# EAGLE design SpeakModule (EAGLE 9.1.0)
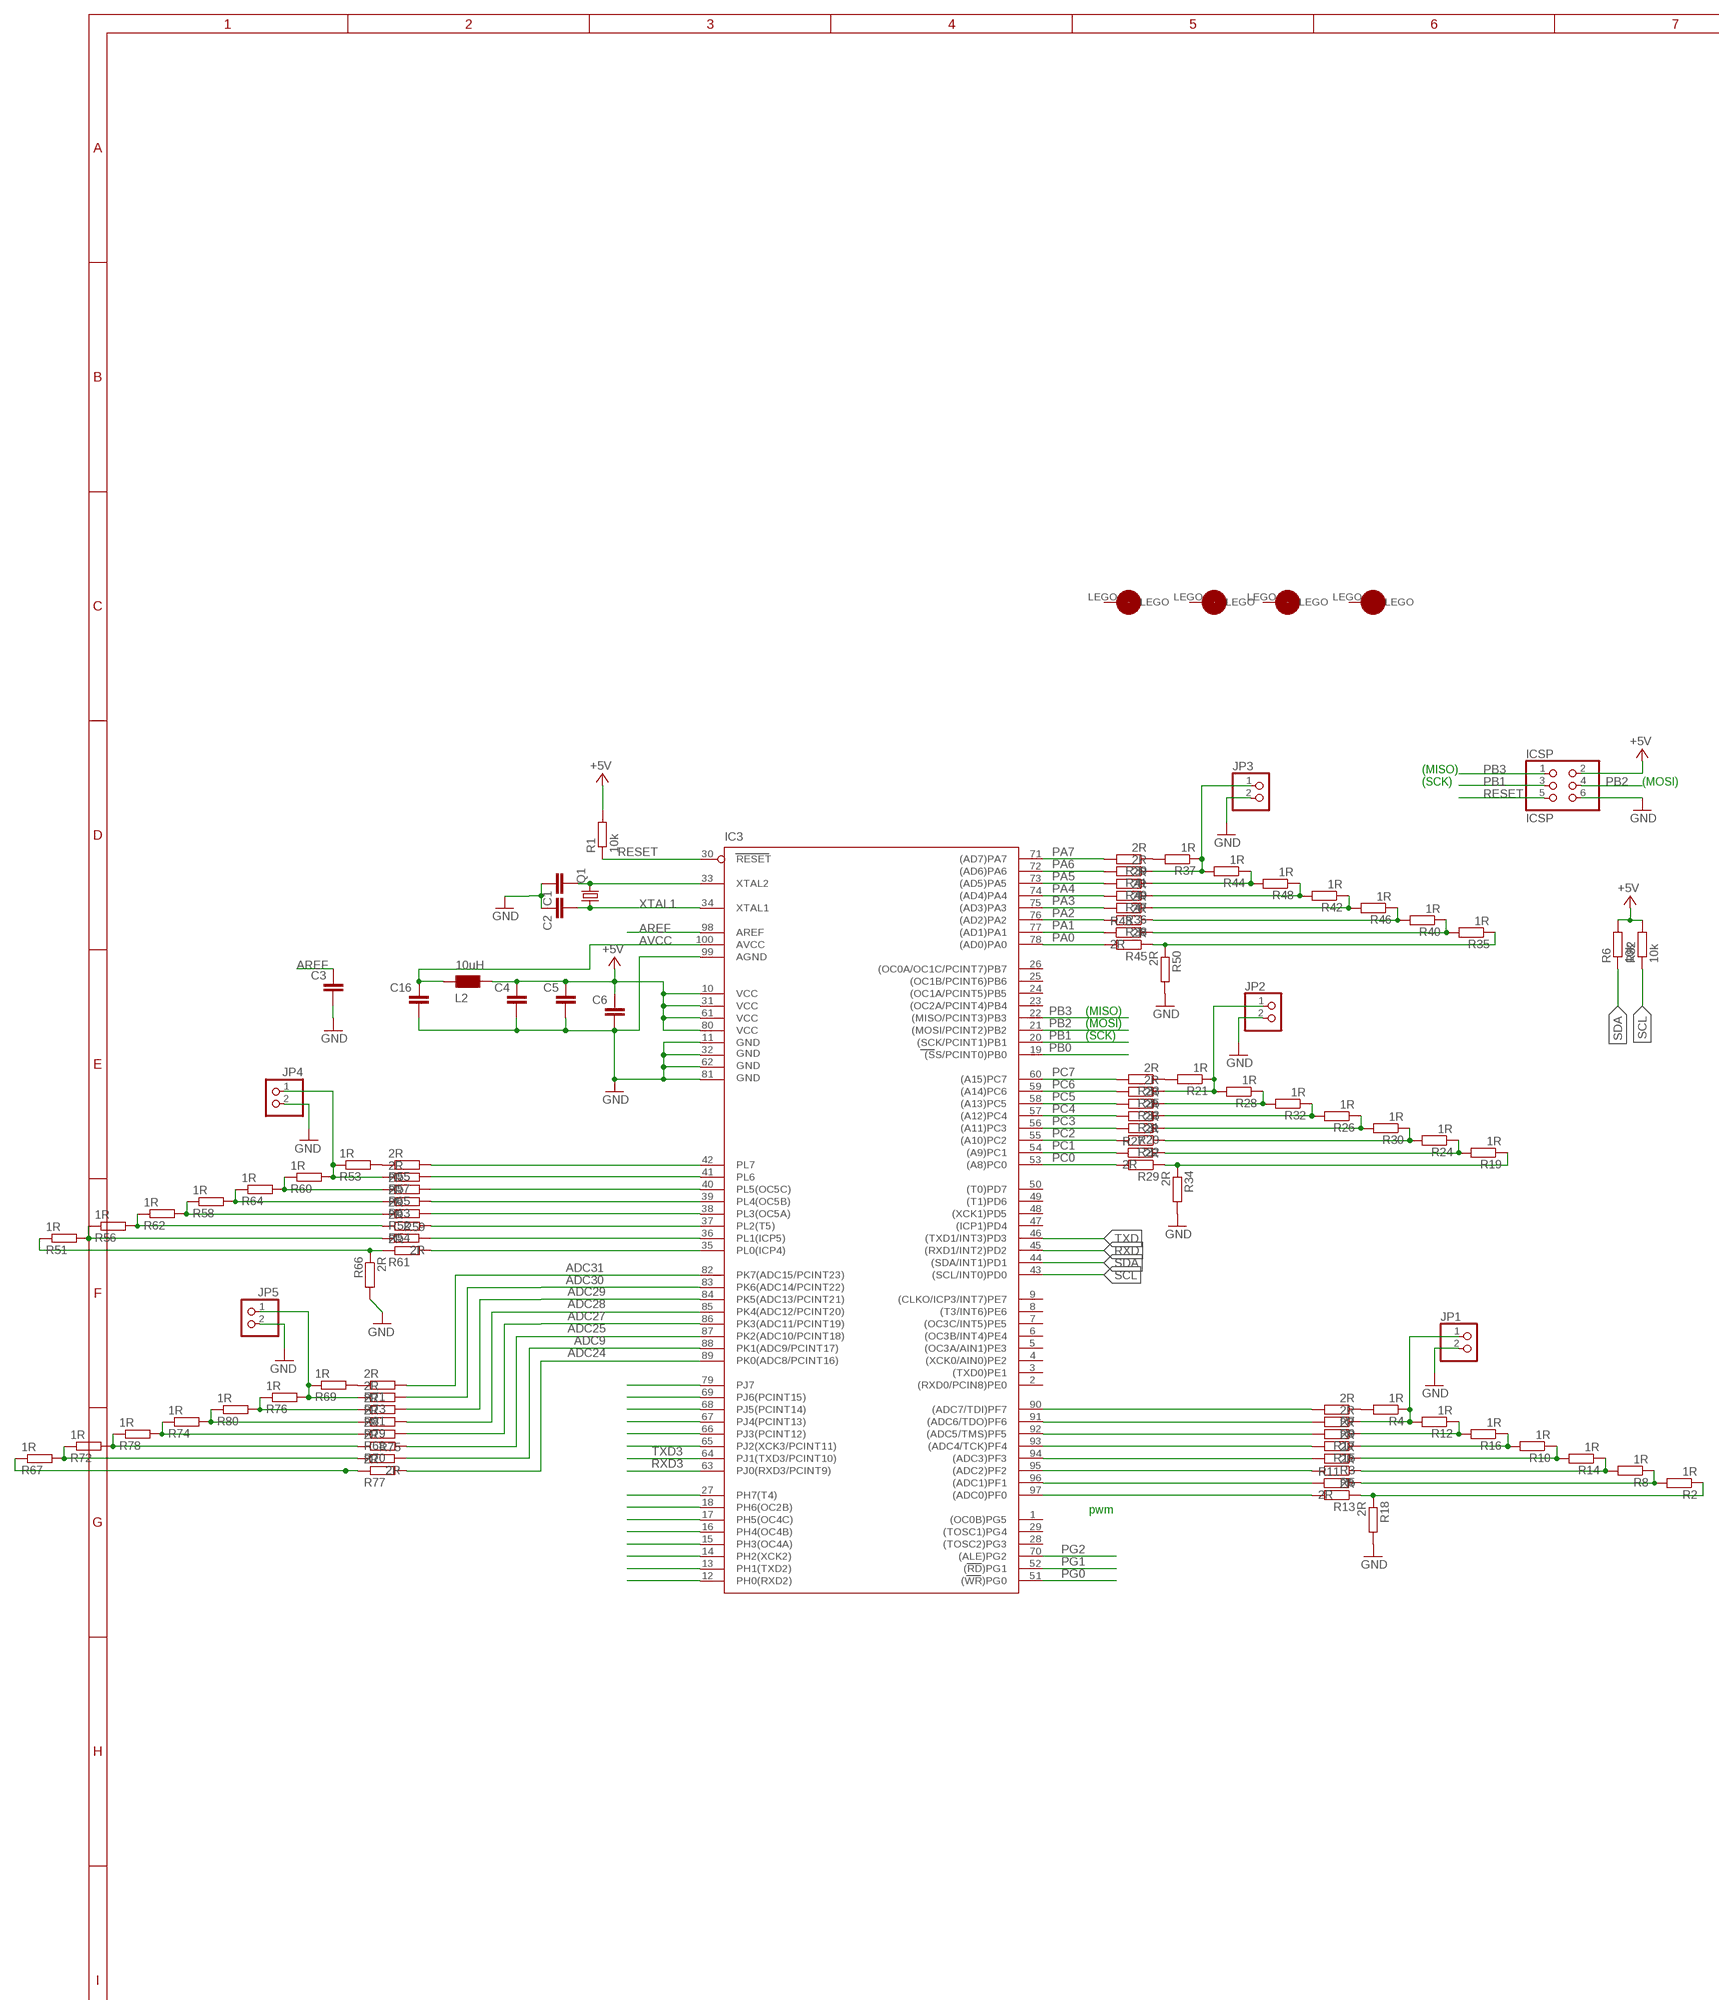
[diagram p0: schematic, sheet 1, part 1 of 2]
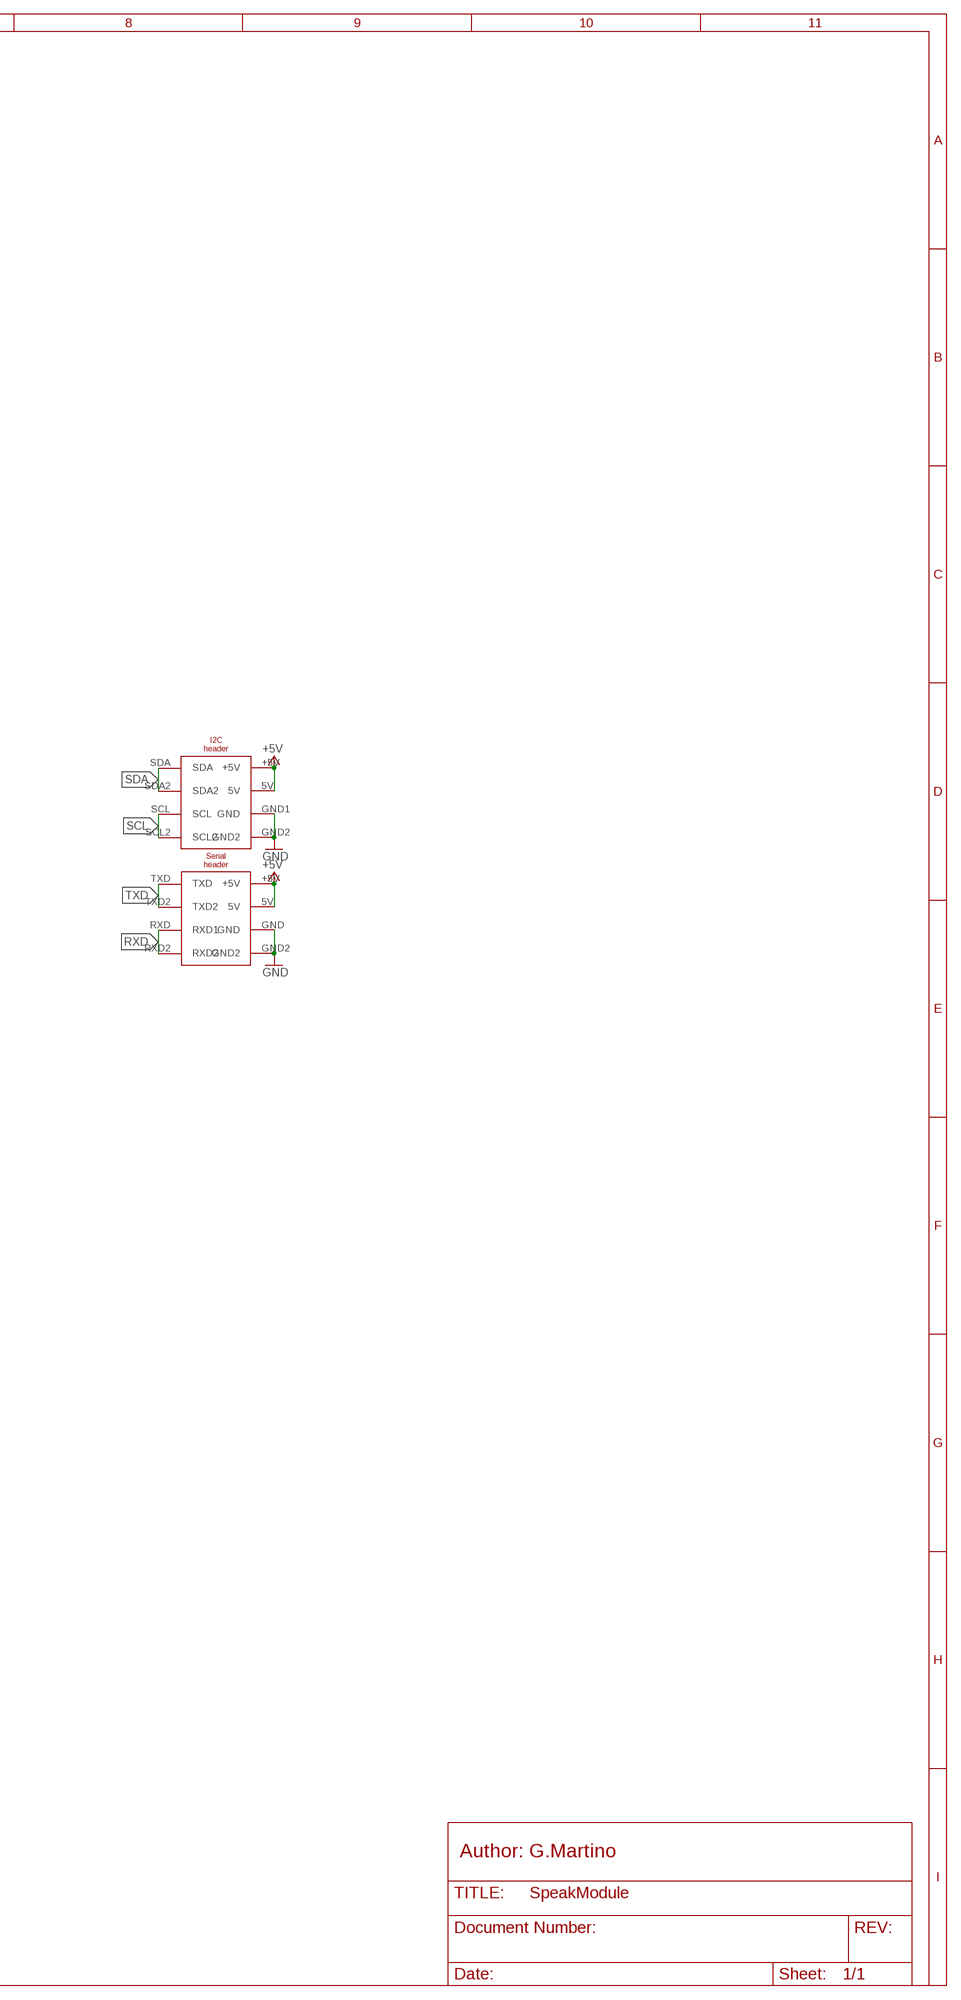
[diagram p1: schematic, sheet 1, part 2 of 2]

## Parts
C1  22pf  C-EUC1206  [C1206]
C2  22pf  C-EUC1206  [C1206]
C3  100nF  C-EUC1206  [C1206]
C4  100nF  C-EUC1206  [C1206]
C5  100nF  C-EUC1206  [C1206]
C6  100nF  C-EUC1206  [C1206]
C16  100nF  C-EUC1206  [C1206]
IC3  ATMEGA2560-15AU  0023_ATMEGA2560-16AU  [TQFP100]
ICSP  ICSP  0114_PH254-203DF118A00V  [2X03]
JP1  PINHD-1X2  [1X02]
JP2  PINHD-1X2  [1X02]
JP3  PINHD-1X2  [1X02]
JP4  PINHD-1X2  [1X02]
JP5  PINHD-1X2  [1X02]
L2  10uH  0715_CV201210-100K  [0805]
Q1  CRYSTALHC49S  [HC49/S]
R1  10k  R-EU_M1206  [M1206]
R2  1R  R-EU_M1206  [M1206]
R3  2R  R-EU_M1206  [M1206]
R4  1R  R-EU_M1206  [M1206]
R5  2R  R-EU_M1206  [M1206]
R6  10k  R-EU_M1206  [M1206]
R7  2R  R-EU_M1206  [M1206]
R8  1R  R-EU_M1206  [M1206]
R9  2R  R-EU_M1206  [M1206]
R10  1R  R-EU_M1206  [M1206]
R11  2R  R-EU_M1206  [M1206]
R12  1R  R-EU_M1206  [M1206]
R13  2R  R-EU_M1206  [M1206]
R14  1R  R-EU_M1206  [M1206]
R15  2R  R-EU_M1206  [M1206]
R16  1R  R-EU_M1206  [M1206]
R17  2R  R-EU_M1206  [M1206]
R18  2R  R-EU_M1206  [M1206]
R19  1R  R-EU_M1206  [M1206]
R20  2R  R-EU_M1206  [M1206]
R21  1R  R-EU_M1206  [M1206]
R22  2R  R-EU_M1206  [M1206]
R23  2R  R-EU_M1206  [M1206]
R24  1R  R-EU_M1206  [M1206]
R25  2R  R-EU_M1206  [M1206]
R26  1R  R-EU_M1206  [M1206]
R27  2R  R-EU_M1206  [M1206]
R28  1R  R-EU_M1206  [M1206]
R29  2R  R-EU_M1206  [M1206]
R30  1R  R-EU_M1206  [M1206]
R31  2R  R-EU_M1206  [M1206]
R32  1R  R-EU_M1206  [M1206]
R33  2R  R-EU_M1206  [M1206]
R34  2R  R-EU_M1206  [M1206]
R35  1R  R-EU_M1206  [M1206]
R36  2R  R-EU_M1206  [M1206]
R37  1R  R-EU_M1206  [M1206]
R38  2R  R-EU_M1206  [M1206]
R39  2R  R-EU_M1206  [M1206]
R40  1R  R-EU_M1206  [M1206]
R41  2R  R-EU_M1206  [M1206]
R42  1R  R-EU_M1206  [M1206]
R43  2R  R-EU_M1206  [M1206]
R44  1R  R-EU_M1206  [M1206]
R45  2R  R-EU_M1206  [M1206]
R46  1R  R-EU_M1206  [M1206]
R47  2R  R-EU_M1206  [M1206]
R48  1R  R-EU_M1206  [M1206]
R49  2R  R-EU_M1206  [M1206]
R50  2R  R-EU_M1206  [M1206]
R51  1R  R-EU_M1206  [M1206]
R52  2R  R-EU_M1206  [M1206]
R53  1R  R-EU_M1206  [M1206]
R54  2R  R-EU_M1206  [M1206]
R55  2R  R-EU_M1206  [M1206]
R56  1R  R-EU_M1206  [M1206]
R57  2R  R-EU_M1206  [M1206]
R58  1R  R-EU_M1206  [M1206]
R59  2R  R-EU_M1206  [M1206]
R60  1R  R-EU_M1206  [M1206]
R61  2R  R-EU_M1206  [M1206]
R62  1R  R-EU_M1206  [M1206]
R63  2R  R-EU_M1206  [M1206]
R64  1R  R-EU_M1206  [M1206]
R65  2R  R-EU_M1206  [M1206]
R66  2R  R-EU_M1206  [M1206]
R67  1R  R-EU_M1206  [M1206]
R68  2R  R-EU_M1206  [M1206]
R69  1R  R-EU_M1206  [M1206]
R70  2R  R-EU_M1206  [M1206]
R71  2R  R-EU_M1206  [M1206]
R72  1R  R-EU_M1206  [M1206]
R73  2R  R-EU_M1206  [M1206]
R74  1R  R-EU_M1206  [M1206]
R75  2R  R-EU_M1206  [M1206]
R76  1R  R-EU_M1206  [M1206]
R77  2R  R-EU_M1206  [M1206]
R78  1R  R-EU_M1206  [M1206]
R79  2R  R-EU_M1206  [M1206]
R80  1R  R-EU_M1206  [M1206]
R81  2R  R-EU_M1206  [M1206]
R82  10k  R-EU_M1206  [M1206]
U$1  LEGO-1X1  [LEGO-1X1]
U$2  LEGO-1X1  [LEGO-1X1]
U$3  LEGO-1X1  [LEGO-1X1]
U$4  LEGO-1X1  [LEGO-1X1]
U$5  I2C_HEADER  [I2_HEADER]
U$6  SERIAL_HEADER  [SERIAL_HEADER]

## Nets
+5V [power usb]: C4.1 C5.1 C6.1 IC3.10(VCC) IC3.31(VCC1) IC3.61(VCC2) IC3.80(VCC3) ICSP.2 L2.2 R1.2 R6.2 R82.2 U$5.5V U$5.+5V U$6.5V U$6.+5V
ADC0: IC3.97((ADC0)PF0) R13.2
ADC1: IC3.96((ADC1)PF1) R11.1
ADC2: IC3.95((ADC2)PF2) R5.2
ADC3: IC3.94((ADC3)PF3) R3.2
ADC4: IC3.93((ADC4/TCK)PF4) R15.2
ADC5: IC3.92((ADC5/TMS)PF5) R17.2
ADC6: IC3.91((ADC6/TDO)PF6) R9.2
ADC7: IC3.90((ADC7/TDI)PF7) R7.2
ADC9: IC3.88(PK1(ADC9/PCINT17)) R75.1
ADC16: IC3.35(PL0(ICP4)) R61.2
ADC17: IC3.37(PL2(T5)) R54.2
ADC18: IC3.36(PL1(ICP5)) R59.1
ADC19: IC3.38(PL3(OC5A)) R52.2
ADC20: IC3.39(PL4(OC5B)) R63.2
ADC21: IC3.40(PL5(OC5C)) R65.2
ADC22: IC3.41(PL6) R57.2
ADC23: IC3.42(PL7) R55.2
ADC24: IC3.89(PK0(ADC8/PCINT16)) R77.2
ADC25: IC3.87(PK2(ADC10/PCINT18)) R70.2
ADC27: IC3.86(PK3(ADC11/PCINT19)) R68.2
ADC28: IC3.85(PK4(ADC12/PCINT20)) R79.2
ADC29: IC3.84(PK5(ADC13/PCINT21)) R81.2
ADC30: IC3.83(PK6(ADC14/PCINT22)) R73.2
ADC31: IC3.82(PK7(ADC15/PCINT23)) R71.2
AREF: C3.1 IC3.98(AREF)
AVCC [power usb]: C16.1 IC3.100(AVCC) L2.1
GND [gnd]: C1.1 C2.1 C3.2 C4.2 C5.2 C6.2 C16.2 IC3.11(GND) IC3.32(GND1) IC3.62(GND2) IC3.81(GND3) IC3.99(AGND) ICSP.6 JP1.2 JP2.2 JP3.2 JP4.2 JP5.2 R18.2 R34.2 R50.2 R66.2 U$5.GND1(GND) U$5.GND2 U$6.GND U$6.GND2
N$1: C1.2 IC3.33(XTAL2) Q1.2
N$2: IC3.27(PH7(T4))
N$3: IC3.18(PH6(OC2B))
N$4: IC3.17(PH5(OC4C))
N$5: IC3.16(PH4(OC4B))
N$6: IC3.15(PH3(OC4A))
N$7: IC3.14(PH2(XCK2))
N$8: IC3.13(PH1(TXD2))
N$9: IC3.12(PH0(RXD2))
N$10: IC3.65(PJ2(XCK3/PCINT11))
N$11: IC3.66(PJ3(PCINT12))
N$12: IC3.67(PJ4(PCINT13))
N$13: IC3.68(PJ5(PCINT14))
N$14: IC3.69(PJ6(PCINT15))
N$15: IC3.79(PJ7)
N$16: R4.2 R7.1
N$17: JP1.1 R4.1 R9.1 R12.2
N$18: R12.1 R16.2 R17.1
N$19: R10.2 R15.1 R16.1
N$20: R3.1 R10.1 R14.2
N$21: R5.1 R8.2 R14.1
N$22: R2.2 R8.1 R11.2
N$23: R2.1 R13.1 R18.1
N$24: R21.2 R23.1
N$25: JP2.1 R21.1 R25.1 R28.2
N$26: R28.1 R32.2 R33.1
N$27: R26.2 R31.1 R32.1
N$28: R20.1 R26.1 R30.2
N$29: R22.1 R24.2 R30.1
N$30: R19.2 R24.1 R27.2
N$31: R19.1 R29.1 R34.1
N$32: R37.2 R39.1
N$33: JP3.1 R37.1 R41.1 R44.2
N$34: R44.1 R48.2 R49.1
N$35: R42.2 R47.1 R48.1
N$36: R36.1 R42.1 R46.2
N$37: R38.1 R40.2 R46.1
N$38: R35.2 R40.1 R43.2
N$39: R35.1 R45.1 R50.1
N$40: R53.2 R55.1
N$41: JP4.1 R53.1 R57.1 R60.2
N$42: R60.1 R64.2 R65.1
N$43: R58.2 R63.1 R64.1
N$44: R52.1 R58.1 R62.2
N$45: R54.1 R56.2 R62.1
N$46: R51.2 R56.1 R59.2
N$47: R51.1 R61.1 R66.1
N$48: R69.2 R71.1
N$49: JP5.1 R69.1 R73.1 R76.2
N$50: R76.1 R80.2 R81.1
N$51: R74.2 R79.1 R80.1
N$52: R68.1 R74.1 R78.2
N$53: R70.1 R72.2 R78.1
N$54: R67.2 R72.1 R75.2
N$55: R67.1 R77.1
PA0: IC3.78((AD0)PA0) R45.2
PA1: IC3.77((AD1)PA1) R43.1
PA2: IC3.76((AD2)PA2) R38.2
PA3: IC3.75((AD3)PA3) R36.2
PA4: IC3.74((AD4)PA4) R47.2
PA5: IC3.73((AD5)PA5) R49.2
PA6: IC3.72((AD6)PA6) R41.2
PA7: IC3.71((AD7)PA7) R39.2
PB0: IC3.19((SS/PCINT0)PB0)
PB1: IC3.20((SCK/PCINT1)PB1) ICSP.3
PB2: IC3.21((MOSI/PCINT2)PB2) ICSP.4
PB3: IC3.22((MISO/PCINT3)PB3) ICSP.1
PC0: IC3.53((A8)PC0) R29.2
PC1: IC3.54((A9)PC1) R27.1
PC2: IC3.55((A10)PC2) R22.2
PC3: IC3.56((A11)PC3) R20.2
PC4: IC3.57((A12)PC4) R31.2
PC5: IC3.58((A13)PC5) R33.2
PC6: IC3.59((A14)PC6) R25.2
PC7: IC3.60((A15)PC7) R23.2
PG0: IC3.51((WR)PG0)
PG1: IC3.52((RD)PG1)
PG2: IC3.70((ALE)PG2)
RESET: IC3.30(RESET) ICSP.5 R1.1
RXD: IC3.45((RXD1/INT2)PD2) U$6.RXD2 U$6.RXD(RXD1)
RXD3: IC3.63(PJ0(RXD3/PCINT9))
SCL: IC3.43((SCL/INT0)PD0) R82.1 U$5.SCL U$5.SCL2
SDA: IC3.44((SDA/INT1)PD1) R6.1 U$5.SDA U$5.SDA2
TXD: IC3.46((TXD1/INT3)PD3) U$6.TXD U$6.TXD2
TXD3: IC3.64(PJ1(TXD3/PCINT10))
XTAL1: C2.2 IC3.34(XTAL1) Q1.1
Unconnected: IC3.1((OC0B)PG5) IC3.2((RXD0/PCIN8)PE0) IC3.3((TXD0)PE1) IC3.4((XCK0/AIN0)PE2) IC3.5((OC3A/AIN1)PE3) IC3.6((OC3B/INT4)PE4) IC3.7((OC3C/INT5)PE5) IC3.8((T3/INT6)PE6) IC3.9((CLKO/ICP3/INT7)PE7) IC3.23((OC2A/PCINT4)PB4) IC3.24((OC1A/PCINT5)PB5) IC3.25((OC1B/PCINT6)PB6) IC3.26((OC0A/OC1C/PCINT7)PB7) IC3.28((TOSC2)PG3) IC3.29((TOSC1)PG4) IC3.47((ICP1)PD4) IC3.48((XCK1)PD5) IC3.49((T1)PD6) IC3.50((T0)PD7) U$1.LEGO U$2.LEGO U$3.LEGO U$4.LEGO

## Notes on the sheet
- (MISO)
- (SCK) | (MOSI)
- (MISO)
- (MOSI)
- (SCK)
- pwm
- Author: G.Martino

## Library data of the parts
C1-C6 C16 = rcl:C-EU: CAPACITOR, European symbol; SPICEPREFIX: C
IC3 = IntegratedCircuits:0023_ATMEGA2560-16AU: 8-bit Microcontroller with 256K Bytes In-System Programmable Flash - ATMEGA2560-16AU; CASE: TQFP100_14x14; MONTHLY_USAGE: _____; PART_NUMBER: ATMEGA2560-16AU; PRICE: _____; SUPPLIER: _____; TYPE: Circuito_Integrato
ICSP = Connettori:0114_PH254-203DF118A00V: 3x2 M V h 8,5 mm p2,54; MONTHLY_USAGE: _____; PART_NUMBER: PH254-203DF118A00V; PRICE: _____; SUPPLIER: _____; TYPE: Connettori
JP1-JP5 = pinhead:PINHD-1X2: PIN HEADER
L2 = Induttanze:0715_CV201210-100K: 10uH 0805; CASE: 0805; MONTHLY_USAGE: _____; PART_NUMBER: CV201210-100K; PRICE: _____; SUPPLIER: _____; TYPE: Induttanze
Q1 = crystal:CRYSTAL: CRYSTAL; OC_FARNELL: 1667008; OC_NEWARK: unknown
R1-R82 = rcl:R-EU_: RESISTOR, European symbol; SPICEPREFIX: R
U$1-U$4 = Cing Library:LEGO-1X1
U$5 = Cing Library:I2C_HEADER
U$6 = Cing Library:SERIAL_HEADER

## Net classes
0 default: width 0.203 mm, drill 0.406 mm, clearance 0.203 mm
1 power: width 0.61 mm, drill 0.406 mm, clearance 0.203 mm
2 gnd: width 0.305 mm, drill 0.406 mm, clearance 0.203 mm
3 power usb: width 0.508 mm, drill 0.406 mm, clearance 0.203 mm

## Board
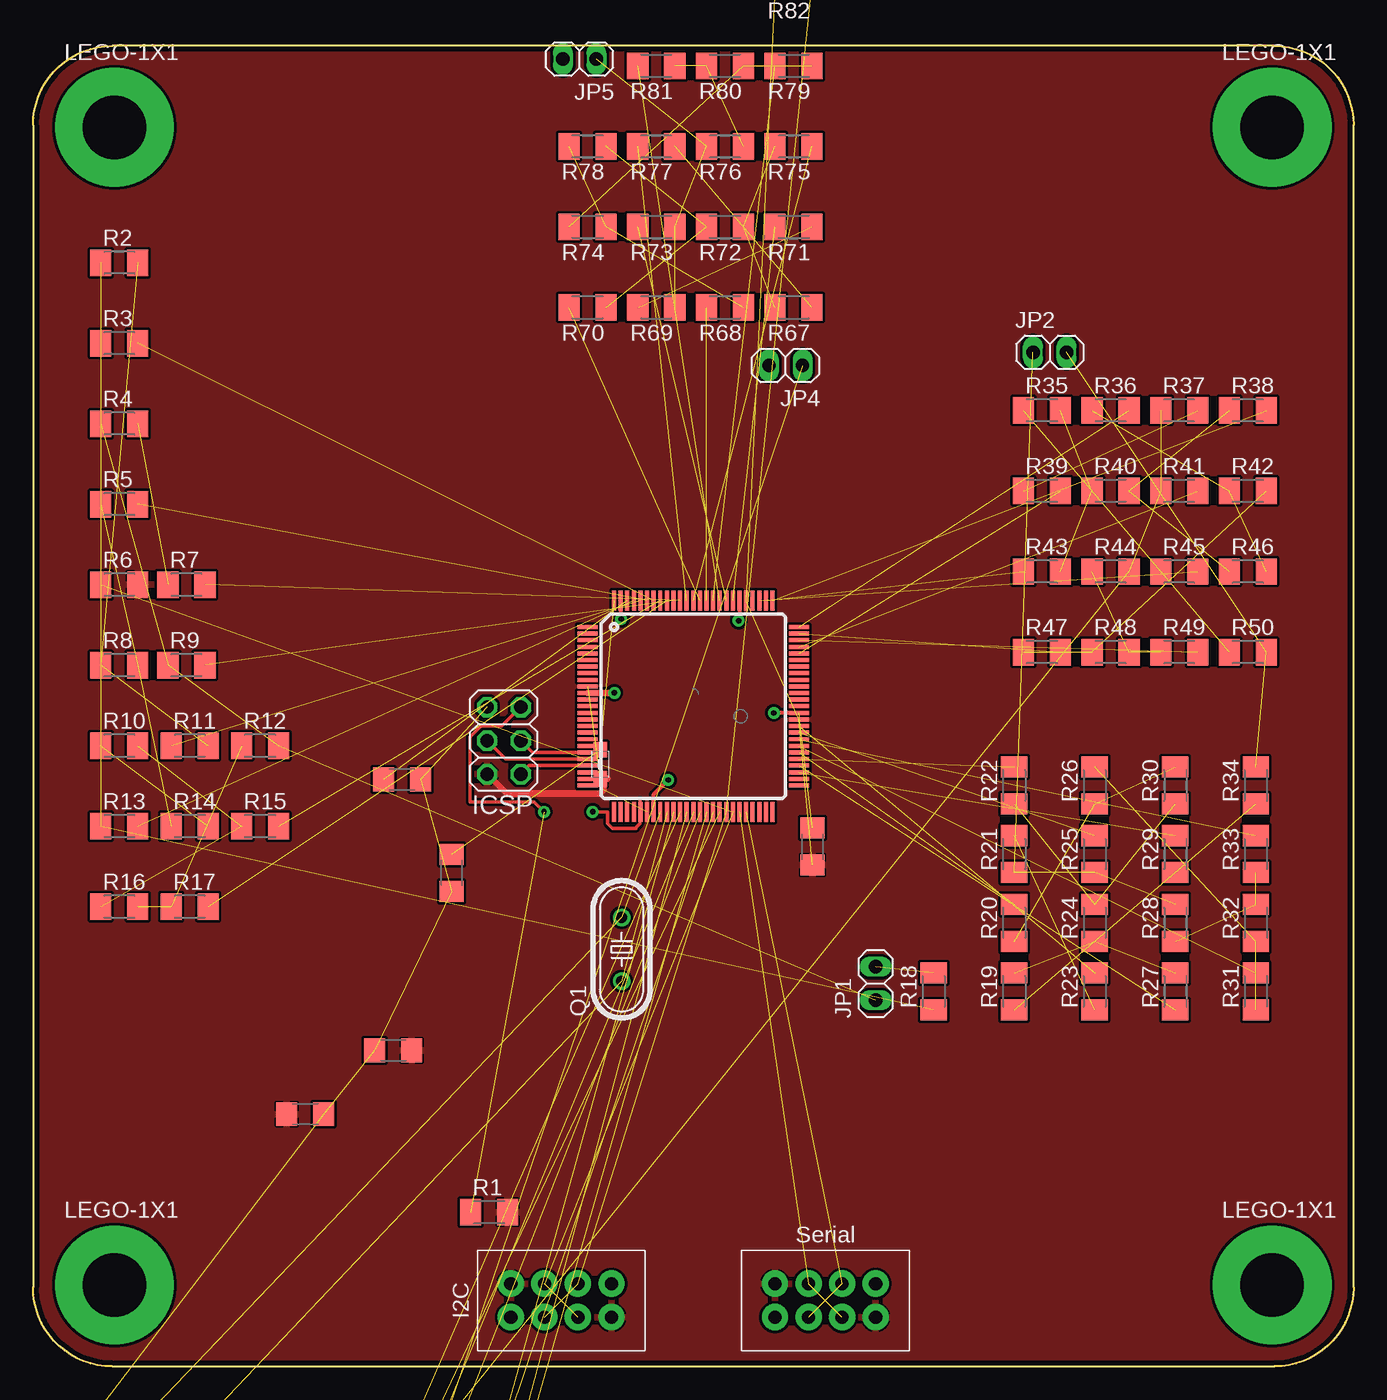
[diagram p2: board, top side]
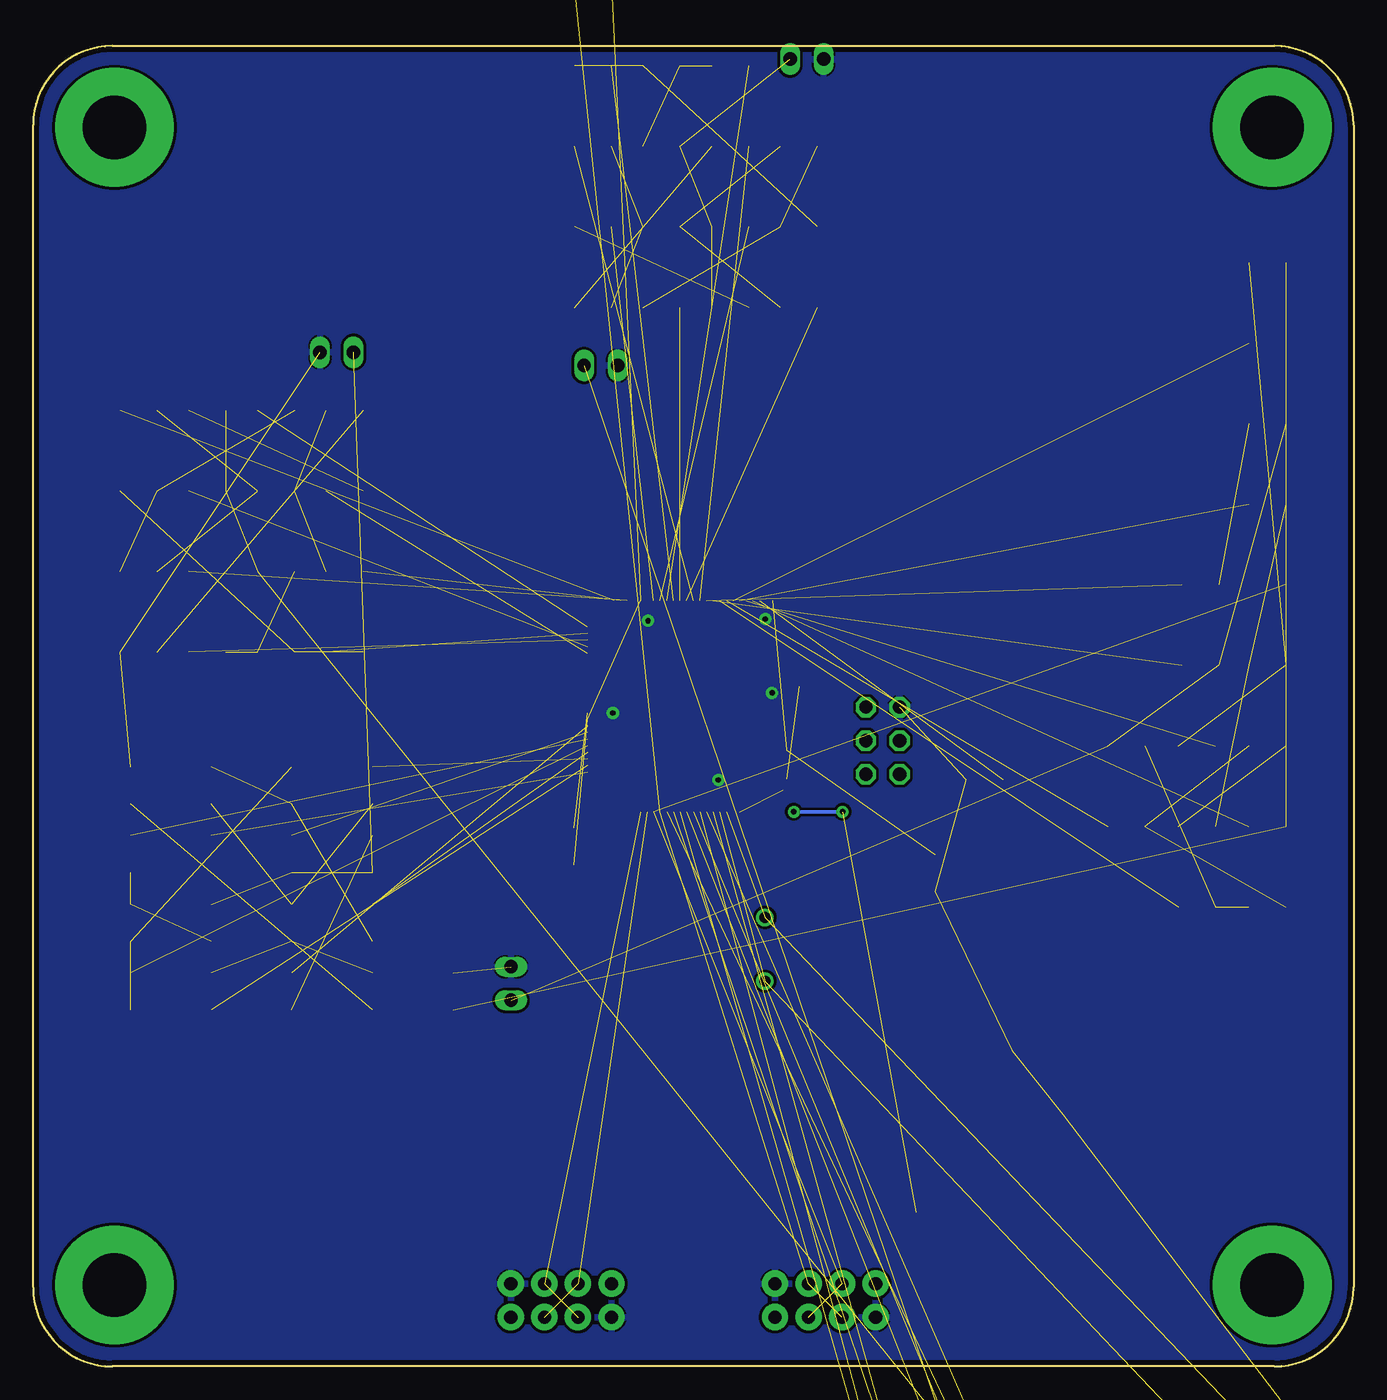
[diagram p3: board, bottom side, seen from below]

Size 100 x 100 mm. Coordinates in mm from the lower left corner, seen from the top.
Outline: 6,0 94,0 arc90 100,6 100,94 arc90 94,100 6,100 arc90 0,94 0,6 arc90 6,0
Copper layers (1*16): Top 0.035mm / dielectric 1.5mm / Bottom 0.035mm
Design rules "ArduinoMega *": minimum track width 5mil, minimum drill 16mil, track to track 3.5mil, track to pad 3.5mil, pad to pad 3.5mil, via to via 3.5mil, smd to smd 3.5mil, copper to edge 15mil, drill to drill 12mil, minimum pad ring 10mil, minimum via ring 10mil, stop-mask expansion 2mil, vias tented up to drill 24mil, thermal gap 5mil

### Footprints (pad centres in the part's own frame; a part is rotated, then mirrored left to right if it is on the bottom)
C1206 = smd 1.6 x 1.8: 1 -1.4,0; 2 1.4,0
TQFP100 = smd 1.5 x 0.3: 1 -8,6; 2 -8,5.5; 3 -8,5; 4 -8,4.5; 5 -8,4; 6 -8,3.5; 7 -8,3; 8 -8,2.5; 9 -8,2; 10 -8,1.5; 11 -8,1; 12 -8,0.5; 13 -8,0; 14 -8,-0.5; 15 -8,-1; 16 -8,-1.5; 17 -8,-2; 18 -8,-2.5; 19 -8,-3; 20 -8,-3.5; 21 -8,-4; 22 -8,-4.5; 23 -8,-5; 24 -8,-5.5; 25 -8,-6; 51 8,-6; 52 8,-5.5; 53 8,-5; 54 8,-4.5; 55 8,-4; 56 8,-3.5; 57 8,-3; 58 8,-2.5; 59 8,-2; 60 8,-1.5; 61 8,-1; 62 8,-0.5; 63 8,0; 64 8,0.5; 65 8,1; 66 8,1.5; 67 8,2; 68 8,2.5; 69 8,3; 70 8,3.5; 71 8,4; 72 8,4.5; 73 8,5; 74 8,5.5; 75 8,6 | smd 0.3 x 1.5: 26 -6,-8; 27 -5.5,-8; 28 -5,-8; 29 -4.5,-8; 30 -4,-8; 31 -3.5,-8; 32 -3,-8; 33 -2.5,-8; 34 -2,-8; 35 -1.5,-8; 36 -1,-8; 37 -0.5,-8; 38 0,-8; 39 0.5,-8; 40 1,-8; 41 1.5,-8; 42 2,-8; 43 2.5,-8; 44 3,-8; 45 3.5,-8; 46 4,-8; 47 4.5,-8; 48 5,-8; 49 5.5,-8; 50 6,-8; 76 6,8; 77 5.5,8; 78 5,8; 79 4.5,8; 80 4,8; 81 3.5,8; 82 3,8; 83 2.5,8; 84 2,8; 85 1.5,8; 86 1,8; 87 0.5,8; 88 0,8; 89 -0.5,8; 90 -1,8; 91 -1.5,8; 92 -2,8; 93 -2.5,8; 94 -3,8; 95 -3.5,8; 96 -4,8; 97 -4.5,8; 98 -5,8; 99 -5.5,8; 100 -6,8
2X03 = drill 1.016 pad 1.55 octagon: 1 -2.54,-1.27; 2 -2.54,1.27; 3 0,-1.27; 4 0,1.27; 5 2.54,-1.27; 6 2.54,1.27
1X02 = drill 1.016 long: 1 -1.27,0; 2 1.27,0
0805 = smd 1.2 x 1: 1 -1.1,0; 2 1.1,0
HC49/S = drill 0.813: 1 -2.413,0; 2 2.413,0
M1206 = smd 1.6 x 2: 1 -1.4,0; 2 1.4,0
LEGO-1X1 = drill 4.8 pad 9: LEGO 0,0
I2_HEADER = drill 1 pad 2: 5V 1.27,3.81; +5V -1.27,-3.81; GND1 -1.27,3.81; GND2 1.27,-3.81; SCL 1.27,-1.27; SCL2 -1.27,1.27; SDA 1.27,1.27; SDA2 -1.27,-1.27
SERIAL_HEADER = drill 1 pad 2: 5V 1.27,3.81; +5V -1.27,-3.81; GND -1.27,3.81; GND2 1.27,-3.81; RXD -1.27,-1.27; RXD2 1.27,1.27; TXD -1.27,1.27; TXD2 1.27,-1.27

### Placement (x,y rotation side)
C1  1.52,-9.65 0 top  (outside the outline)
C2  1.52,-14.73 0 top  (outside the outline)
C3  27.94,44.45 0 top
C4  20.61,19.11 0 top
C5  59.03,39.37 90 top
C6  27.28,23.94 180 top
C16  31.7,37.38 270 top
IC3  50,50 0 top
ICSP  35.66,47.4 90 top
JP1  63.8,29 90 top
JP2  77,76.8 0 top
JP3  13,-28.5 0 top  (outside the outline)
JP4  57,75.8 180 top
JP5  41.4,99 180 top
L2  42.96,45.6 270 top
Q1  44.57,31.59 90 top
R1  34.54,11.68 0 top
R2  6.54,83.58 0 top
R3  6.54,77.49 0 top
R4  6.54,71.39 0 top
R5  6.54,65.3 0 top
R6  6.54,59.2 0 top
R7  11.62,59.2 0 top
R8  6.54,53.1 0 top
R9  11.62,53.1 0 top
R10  6.54,47.01 0 top
R11  11.87,47.01 0 top
R12  17.21,47.01 0 top
R13  6.54,40.91 0 top
R14  11.87,40.91 0 top
R15  17.21,40.91 0 top
R16  6.54,34.82 0 top
R17  11.87,34.82 0 top
R18  68.2,28.4 90 top
R19  74.3,28.4 90 top
R20  74.3,33.6 90 top
R21  74.3,38.8 90 top
R22  74.3,44 90 top
R23  80.4,28.4 90 top
R24  80.4,33.6 90 top
R25  80.4,38.8 90 top
R26  80.4,44 90 top
R27  86.5,28.4 90 top
R28  86.5,33.6 90 top
R29  86.5,38.8 90 top
R30  86.5,44 90 top
R31  92.6,28.4 90 top
R32  92.6,33.6 90 top
R33  92.6,38.8 90 top
R34  92.6,44 90 top
R35  76.4,72.4 0 top
R36  81.6,72.4 0 top
R37  86.8,72.4 0 top
R38  92,72.4 0 top
R39  76.4,66.3 0 top
R40  81.6,66.3 0 top
R41  86.8,66.3 0 top
R42  92,66.3 0 top
R43  76.4,60.2 0 top
R44  81.6,60.2 0 top
R45  86.8,60.2 0 top
R46  92,60.2 0 top
R47  76.4,54.1 0 top
R48  81.6,54.1 0 top
R49  86.8,54.1 0 top
R50  92,54.1 0 top
R51  12.4,-32.9 0 top  (outside the outline)
R52  17.6,-32.9 0 top  (outside the outline)
R53  22.8,-32.9 0 top  (outside the outline)
R54  28,-32.9 0 top  (outside the outline)
R55  12.4,-39 0 top  (outside the outline)
R56  17.6,-39 0 top  (outside the outline)
R57  22.8,-39 0 top  (outside the outline)
R58  28,-39 0 top  (outside the outline)
R59  12.4,-45.1 0 top  (outside the outline)
R60  17.6,-45.1 0 top  (outside the outline)
R61  22.8,-45.1 0 top  (outside the outline)
R62  28,-45.1 0 top  (outside the outline)
R63  12.4,-51.2 0 top  (outside the outline)
R64  17.6,-51.2 0 top  (outside the outline)
R65  22.8,-51.2 0 top  (outside the outline)
R66  28,-51.2 0 top  (outside the outline)
R67  57.6,80.2 180 top
R68  52.4,80.2 180 top
R69  47.2,80.2 180 top
R70  42,80.2 180 top
R71  57.6,86.3 180 top
R72  52.4,86.3 180 top
R73  47.2,86.3 180 top
R74  42,86.3 180 top
R75  57.6,92.4 180 top
R76  52.4,92.4 180 top
R77  47.2,92.4 180 top
R78  42,92.4 180 top
R79  57.6,98.5 180 top
R80  52.4,98.5 180 top
R81  47.2,98.5 180 top
R82  57.6,104.6 180 top  (outside the outline)
U$1  93.84,93.84 0 top
U$2  93.84,6.16 0 top
U$3  6.16,93.84 0 top
U$4  6.16,6.16 0 top
U$5  40,5 90 top
U$6  60,5 270 top

### Tracks (layer width: path | path; a pad name or v marks a point on that pad's centre or on a via)
+5V  (5 unrouted)
  Top 0.508: 43.21,44.5 43.21,43.66 42.94,43.39 35.85,43.39 ICSP.2 | 43.49,44.5 43.21,44.5 | 43.49,44.5 43.52,44.54 43.49,44.5 | 43.21,44.5 43.49,44.5
  pour Top: -4,104 106,104 106,-4 -4,-4
ADC0  (1 unrouted)
ADC1  (1 unrouted)
ADC2  (1 unrouted)
ADC3  (1 unrouted)
ADC4  (1 unrouted)
ADC5  (1 unrouted)
ADC6  (1 unrouted)
ADC7  (1 unrouted)
ADC9  (1 unrouted)
ADC16  (1 unrouted)
ADC17  (1 unrouted)
ADC18  (1 unrouted)
ADC19  (1 unrouted)
ADC20  (1 unrouted)
ADC21  (1 unrouted)
ADC22  (1 unrouted)
ADC23  (1 unrouted)
ADC24  (1 unrouted)
ADC25  (1 unrouted)
ADC27  (1 unrouted)
ADC28  (1 unrouted)
ADC29  (1 unrouted)
ADC30  (1 unrouted)
ADC31  (1 unrouted)
AREF  (1 unrouted)
AVCC  (2 unrouted)
GND  (via drill 0.41)  (12 unrouted)
  Top 0.3: IC3.62 v56.1,49.5 | IC3.99 44.5,56.64
  Top 0.305: IC3.32 47,42.89 | 47,42.89 47,43.32 v48.09,44.41 | IC3.81 53.5,56.55 | 47,42.89
  Top 0.508: v44.03,51.02 44.02,51 IC3.11 | v56.1,49.5 v56.1,49.49 | 44.5,56.64 v44.54,56.6 | 53.5,56.55 v53.43,56.48
  pour Bottom: -4,-4 -4,104 106,104 106,-4
N$1  (2 unrouted)
N$16  (1 unrouted)
N$17  (3 unrouted)
N$18  (2 unrouted)
N$19  (2 unrouted)
N$20  (2 unrouted)
N$21  (2 unrouted)
N$22  (2 unrouted)
N$23  (2 unrouted)
N$24  (1 unrouted)
N$25  (3 unrouted)
N$26  (2 unrouted)
N$27  (2 unrouted)
N$28  (2 unrouted)
N$29  (2 unrouted)
N$30  (2 unrouted)
N$31  (2 unrouted)
N$32  (1 unrouted)
N$33  (3 unrouted)
N$34  (2 unrouted)
N$35  (2 unrouted)
N$36  (2 unrouted)
N$37  (2 unrouted)
N$38  (2 unrouted)
N$39  (2 unrouted)
N$40  (1 unrouted)
N$41  (3 unrouted)
N$42  (2 unrouted)
N$43  (2 unrouted)
N$44  (2 unrouted)
N$45  (2 unrouted)
N$46  (2 unrouted)
N$47  (2 unrouted)
N$48  (1 unrouted)
N$49  (3 unrouted)
N$50  (2 unrouted)
N$51  (2 unrouted)
N$52  (2 unrouted)
N$53  (2 unrouted)
N$54  (2 unrouted)
N$55  (1 unrouted)
PA0  (1 unrouted)
PA1  (1 unrouted)
PA2  (1 unrouted)
PA3  (1 unrouted)
PA4  (1 unrouted)
PA5  (1 unrouted)
PA6  (1 unrouted)
PA7  (1 unrouted)
PB1
  Top 0.254: IC3.20 37.83,46.5 ICSP.3
PB2
  Top 0.254: IC3.21 35.78,46 ICSP.4
PB3
  Top 0.254: IC3.22 37.56,45.5 ICSP.1
PC0  (1 unrouted)
PC1  (1 unrouted)
PC2  (1 unrouted)
PC3  (1 unrouted)
PC4  (1 unrouted)
PC5  (1 unrouted)
PC6  (1 unrouted)
PC7  (1 unrouted)
RESET  (via drill 0.41)  (1 unrouted)
  Top 0.254: ICSP.5 35.49,48.51 33.93,48.51 33.11,47.69 33.11,42.76 37.3,42.76 37.94,42.76 v38.7,42 | 45.98,42.89 45.98,42.02 IC3.30 45.98,41.98 45.98,41.11 45.68,40.81 45.68,40.73 43.9,40.73 43.52,41.11 43.52,42 v42.38,42
  Bottom 0.254: v42.38,42 v38.7,42
RXD  (2 unrouted)
SCL  (3 unrouted)
SDA  (3 unrouted)
TXD  (2 unrouted)
XTAL1  (2 unrouted)